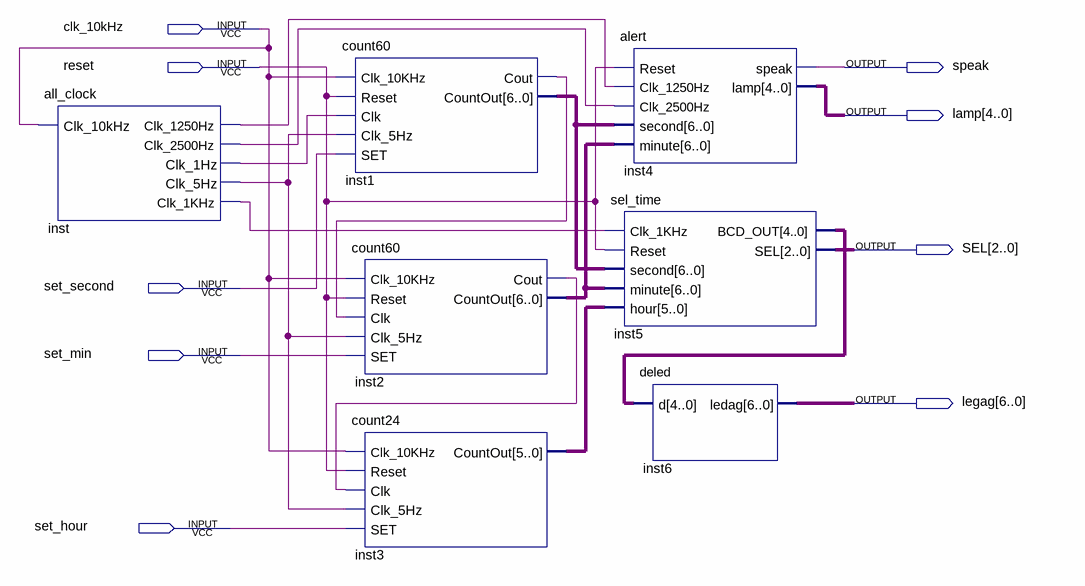
[diagram p0: schematic sheet]
// Quartus schematic exp6.bdf as structural Verilog: 7 symbols, 9 pins
module exp6 (
  input  clk_10kHz,
  input  reset,
  input  set_second,
  input  set_min,
  input  set_hour,
  output speak,
  output [4:0] lamp,
  output [2:0] SEL,
  output [6:0] legag
);

  wire inst1_cout, inst2_cout, inst_clk_1hz, inst_clk_1khz, inst_clk_5hz, inst_clk_1250hz, inst_clk_2500hz;
  wire [4:0] inst5_bcd_out;
  wire [5:0] inst3_countout;
  wire [6:0] inst1_countout, inst2_countout;

  all_clock inst (
    .Clk_10kHz(clk_10kHz), .Clk_1250Hz(inst_clk_1250hz), .Clk_2500Hz(inst_clk_2500hz),
    .Clk_1Hz(inst_clk_1hz), .Clk_5Hz(inst_clk_5hz), .Clk_1KHz(inst_clk_1khz));
  count60 inst1 (
    .Clk_10KHz(clk_10kHz), .Reset(reset), .Clk(inst_clk_1hz), .Clk_5Hz(inst_clk_5hz), .SET(set_second),
    .Cout(inst1_cout), .CountOut(inst1_countout));
  count60 inst2 (
    .Clk_10KHz(clk_10kHz), .Reset(reset), .Clk(inst1_cout), .Clk_5Hz(inst_clk_5hz), .SET(set_min),
    .Cout(inst2_cout), .CountOut(inst2_countout));
  count24 inst3 (
    .Clk_10KHz(clk_10kHz), .Reset(reset), .Clk(inst2_cout), .Clk_5Hz(inst_clk_5hz), .SET(set_hour),
    .CountOut(inst3_countout));
  alert inst4 (
    .Reset(reset), .Clk_1250Hz(inst_clk_1250hz), .Clk_2500Hz(inst_clk_2500hz), .second(inst1_countout),
    .minute(inst2_countout), .speak(speak), .lamp(lamp));
  sel_time inst5 (
    .Clk_1KHz(inst_clk_1khz), .Reset(reset), .second(inst1_countout), .minute(inst2_countout),
    .hour(inst3_countout), .BCD_OUT(inst5_bcd_out), .SEL(SEL));
  deled inst6 (.d(inst5_bcd_out), .ledag(legag));
endmodule
